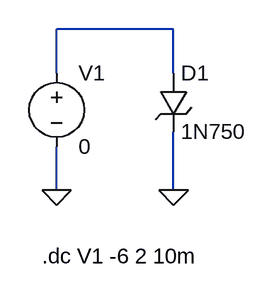
[diagram p0: schematic Diode curve.asc]
Diode curve.asc, the LTspice schematic file:
Version 4
SHEET 1 1540 680
WIRE 192 64 64 64
WIRE 64 112 64 64
WIRE 192 112 192 64
WIRE 64 240 64 192
WIRE 192 240 192 176
FLAG 64 240 0
FLAG 192 240 0
SYMBOL zener 176 112 R0
SYMATTR InstName D1
SYMATTR Value 1N750
SYMATTR Description Diode
SYMATTR Type diode
SYMBOL voltage 64 96 R0
SYMATTR InstName V1
SYMATTR Value 0
TEXT 48 312 Left 2 !.dc V1 -6 2 10m

The netlist it stands for:
* Diode curve.asc
D1 N001 0 1N750
V1 N001 0 0
.model D D
.lib standard.dio
.dc V1 -6 2 10m
.backanno
.end